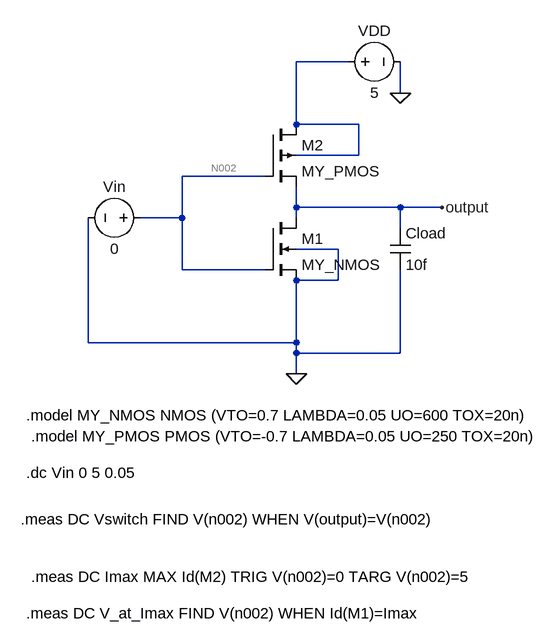
[diagram p0: schematic short_ckt_current.asc]
short_ckt_current.asc, the LTspice schematic file:
Version 4.1
SHEET 1 880 784
WIRE 336 -160 256 -160
WIRE 416 -112 416 -160
WIRE 256 -64 256 -160
WIRE 352 -64 256 -64
WIRE 352 -16 352 -64
WIRE 352 -16 256 -16
WIRE 208 16 80 16
WIRE 256 64 256 32
WIRE 416 64 256 64
WIRE 480 64 416 64
WIRE 80 80 80 16
WIRE 80 80 16 80
WIRE 256 80 256 64
WIRE 416 96 416 64
WIRE 320 128 256 128
WIRE 80 160 80 80
WIRE 208 160 80 160
WIRE 320 176 320 128
WIRE 320 176 256 176
WIRE -64 272 -64 80
WIRE 256 272 256 176
WIRE 256 272 -64 272
WIRE 256 288 256 272
WIRE 416 288 416 160
WIRE 416 288 256 288
WIRE 256 320 256 288
FLAG 256 320 0
FLAG 416 -112 0
FLAG 480 64 output
SYMBOL nmos4 208 80 R0
SYMATTR InstName M1
SYMATTR Value MY_NMOS
SYMATTR Value2 l=1u w=1u
SYMBOL voltage 32 80 R90
WINDOW 0 -32 56 VBottom 2
WINDOW 3 32 56 VTop 2
WINDOW 123 0 0 Left 0
WINDOW 39 0 0 Left 0
SYMATTR InstName Vin
SYMATTR Value 0
SYMBOL voltage 320 -160 R270
WINDOW 0 32 56 VTop 2
WINDOW 3 -32 56 VBottom 2
WINDOW 123 0 0 Left 0
WINDOW 39 0 0 Left 0
SYMATTR InstName VDD
SYMATTR Value 5
SYMBOL cap 400 96 R0
SYMATTR InstName Cload
SYMATTR Value 10f
SYMBOL pmos4 208 -64 R0
SYMATTR InstName M2
SYMATTR Value MY_PMOS
SYMATTR Value2 l=1u w=1u
TEXT -160 384 Left 2 !.model MY_NMOS NMOS (VTO=0.7 LAMBDA=0.05 UO=600 TOX=20n)
TEXT -152 416 Left 2 !.model MY_PMOS PMOS (VTO=-0.7 LAMBDA=0.05 UO=250 TOX=20n)
TEXT -160 472 Left 2 !.dc Vin 0 5 0.05
TEXT -168 544 Left 2 !.meas DC Vswitch FIND V(n002) WHEN V(output)=V(n002)
TEXT -152 632 Left 2 !.meas DC Imax MAX Id(M2) TRIG V(n002)=0 TARG V(n002)=5
TEXT -160 688 Left 2 !.meas DC V_at_Imax FIND V(n002) WHEN Id(M1)=Imax

The netlist it stands for:
* short_ckt_current.asc
M1 output N002 0 0 MY_NMOS l=1u w=1u
Vin N002 0 0
VDD N001 0 5
Cload output 0 10f
M2 N001 N002 output N001 MY_PMOS l=1u w=1u
.model NMOS NMOS
.model PMOS PMOS
.lib standard.mos
.model MY_NMOS NMOS (VTO=0.7 LAMBDA=0.05 UO=600 TOX=20n)
.model MY_PMOS PMOS (VTO=-0.7 LAMBDA=0.05 UO=250 TOX=20n)
.dc Vin 0 5 0.05
.meas DC Vswitch FIND V(n002) WHEN V(output)=V(n002)
.meas DC Imax MAX Id(M2) TRIG V(n002)=0 TARG V(n002)=5
.meas DC V_at_Imax FIND V(n002) WHEN Id(M1)=Imax
.backanno
.end